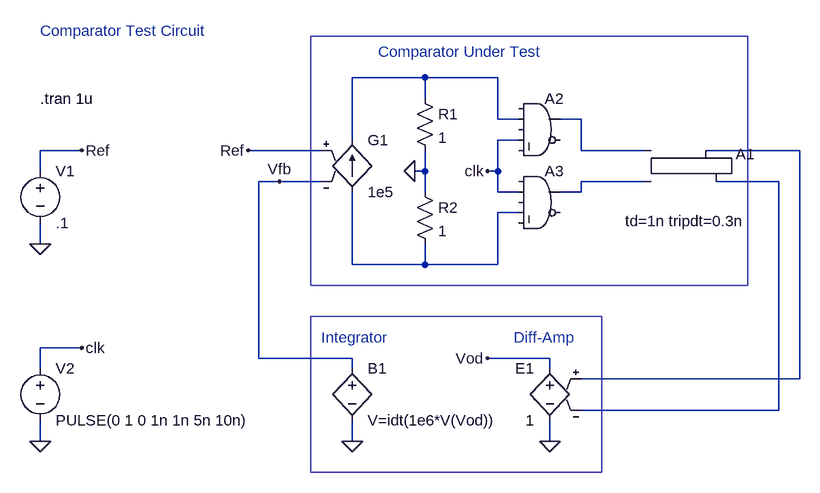
[diagram p0: schematic comparator_test.asc]
comparator_test.asc, the LTspice schematic file:
Version 4
SHEET 1 880 680
WIRE 176 -16 64 -16
WIRE 288 -16 176 -16
WIRE 176 16 176 -16
WIRE 288 48 288 -16
WIRE 320 48 288 48
WIRE 416 48 384 48
WIRE 64 80 64 -16
WIRE 320 80 288 80
WIRE -352 96 -416 96
WIRE 16 96 -96 96
WIRE 416 96 416 48
WIRE 512 96 416 96
WIRE 752 96 608 96
WIRE -416 128 -416 96
WIRE 176 128 176 96
WIRE 176 128 160 128
WIRE 288 128 288 80
WIRE 288 128 272 128
WIRE -48 144 -80 144
WIRE 16 144 -48 144
WIRE 512 144 416 144
WIRE 720 144 624 144
WIRE 176 160 176 128
WIRE 288 160 288 128
WIRE 320 160 288 160
WIRE 416 160 416 144
WIRE 416 160 384 160
WIRE 320 192 288 192
WIRE -416 240 -416 208
WIRE 64 272 64 160
WIRE 176 272 176 240
WIRE 176 272 64 272
WIRE 288 272 288 192
WIRE 288 272 176 272
WIRE -352 400 -416 400
WIRE -80 416 -80 144
WIRE 64 416 -80 416
WIRE 368 416 272 416
WIRE -416 432 -416 400
WIRE 64 432 64 416
WIRE 368 432 368 416
WIRE 752 448 752 96
WIRE 752 448 416 448
WIRE 720 496 720 144
WIRE 720 496 416 496
WIRE -416 544 -416 512
WIRE 64 544 64 512
WIRE 368 544 368 512
FLAG 160 128 0
FLAG 272 128 clk
FLAG 64 544 0
FLAG 368 544 0
FLAG 272 416 Vod
FLAG -96 96 Ref
FLAG -416 240 0
FLAG -416 544 0
FLAG -352 96 Ref
FLAG -352 400 clk
FLAG -48 144 Vfb
SYMBOL bv 64 416 R0
SYMATTR InstName B1
SYMATTR Value V=idt(1e6*V(Vod))
SYMBOL Digital\\srflop 560 48 R0
WINDOW 39 -76 157 Left 0
SYMATTR InstName A1
SYMATTR SpiceLine td=1n tripdt=0.3n
SYMBOL Digital\\and 352 0 R0
SYMATTR InstName A2
SYMBOL Digital\\and 352 112 R0
SYMATTR InstName A3
SYMBOL res 160 0 R0
SYMATTR InstName R1
SYMATTR Value 1
SYMBOL res 160 144 R0
SYMATTR InstName R2
SYMATTR Value 1
SYMBOL g 64 64 R0
SYMATTR InstName G1
SYMATTR Value 1e5
SYMBOL e 368 416 M0
SYMATTR InstName E1
SYMATTR Value 1
SYMBOL voltage -416 112 R0
SYMATTR InstName V1
SYMATTR Value .1
SYMBOL voltage -416 416 R0
WINDOW 123 0 0 Left 0
WINDOW 39 0 0 Left 0
SYMATTR InstName V2
SYMATTR Value PULSE(0 1 0 1n 1n 5n 10n)
TEXT -416 16 Left 0 !.tran 1u
TEXT -416 -88 Left 0 ;Comparator Test Circuit
TEXT 16 384 Left 0 ;Integrator
TEXT 312 384 Left 0 ;Diff-Amp
TEXT 104 -56 Left 0 ;Comparator Under Test
RECTANGLE Normal 672 304 0 -80
RECTANGLE Normal 448 592 0 352

The netlist it stands for:
* comparator_test.asc
B1 Vfb 0 V=idt(1e6*V(Vod))
A1 N002 N004 0 0 0 N005 N003 0 SRFLOP td=1n tripdt=0.3n
A2 0 N001 0 clk 0 0 N002 0 AND
A3 0 clk 0 N006 0 0 N004 0 AND
R1 N001 0 1
R2 0 N006 1
G1 N006 N001 Ref Vfb 1e5
E1 Vod 0 N003 N005 1
V1 Ref 0 .1
V2 clk 0 PULSE(0 1 0 1n 1n 5n 10n)
.tran 1u
* Comparator Test Circuit
* Integrator
* Diff-Amp
* Comparator Under Test
.backanno
.end